# Altium schematic sheet BW1097_HDMI.SchDoc: =project_title
size Tabloid; CompanyName: Luxonis Holding; Organization: Luxonis Holding; Address1: 1925 Harmony Park Drive; Address2: Westminster, CO; Address3: 80234; Address4: United States; SheetNumber: 12; SheetTotal: 17
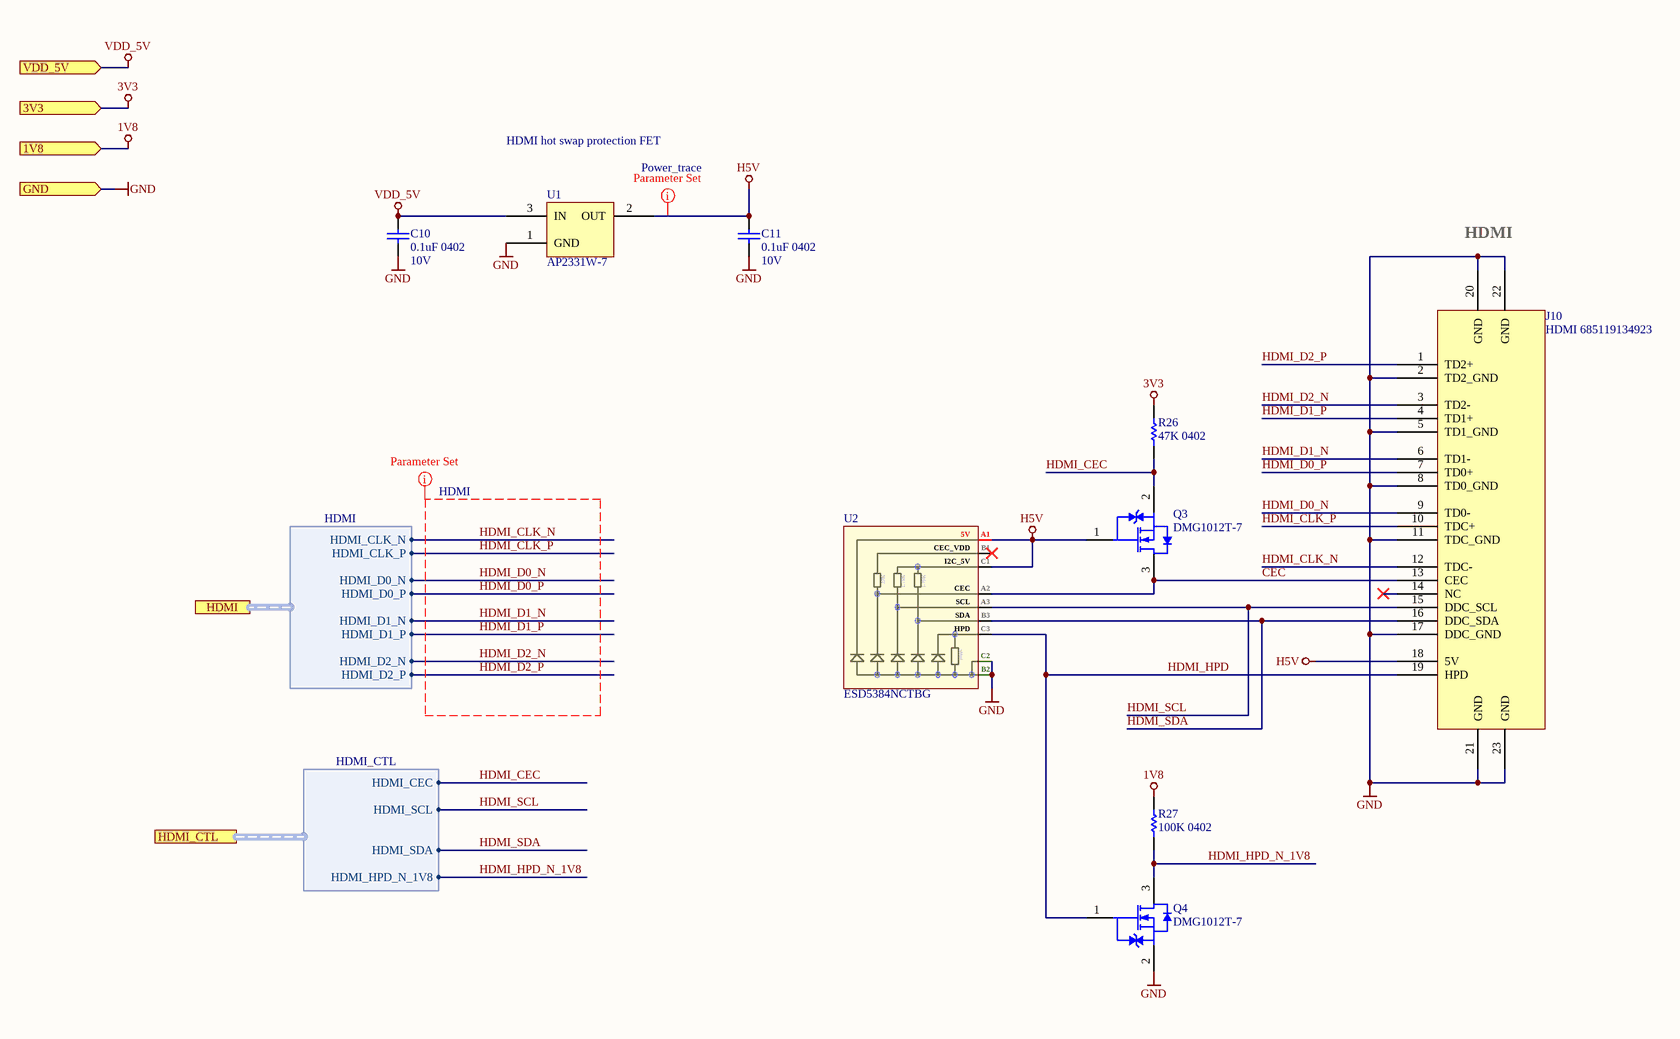
[diagram p0: BW1097_HDMI.SchDoc]

## Parts
C10  0.1uF 0402  Voltage Rating: 10V  [CAPC0402(1005)70_N]
C11  0.1uF 0402  Voltage Rating: 10V  [CAPC0402(1005)70_N]
J10  HDMI 685119134923  [685119134923]
Q3  DMG1012T-7  [DMG1012T-7]
Q4  DMG1012T-7  [DMG1012T-7]
R26  47K 0402  [RESC0402(1005)_N]
R27  100K 0402  [RESC0402(1005)_N]
U1  AP2331W-7  [AP2331W-7]
U2  ESD5384NCTBG  [ESD5384NCTBG]

## Ports
1V8 (in), 3V3 (in), GND (in), HDMI (harness HDMI), HDMI_CTL (harness HDMI_CTL), VDD_5V (in)

## Harnesses
HDMI_CTL: HDMI_CEC, HDMI_SCL, HDMI_SDA, HDMI_HPD_N_1V8
HDMI: HDMI_CLK_N, HDMI_CLK_P, HDMI_D0_N, HDMI_D0_P, HDMI_D1_N, HDMI_D1_P, HDMI_D2_N, HDMI_D2_P

## Nets
1V8: R27.2 ; port 1V8
3V3: R26.2 ; port 3V3
GND: C10.1 C11.1 J10.2(TD2_GND) J10.5(TD1_GND) J10.8(TD0_GND) J10.11(TDC_GND) J10.17(DDC_GND) J10.20(GND) J10.21(GND) J10.22(GND) J10.23(GND) Q4.2 U1.1(GND) U2.B2 U2.C2 ; port GND
H5V: C11.2 J10.18(5V) Q3.1 U1.2(OUT) U2.A1 U2.C1
VDD_5V: C10.2 U1.3(IN) ; port VDD_5V
CEC: J10.13(CEC) Q3.3 U2.A2
HDMI_CEC: Q3.2 R26.1 ; port HDMI_CTL.HDMI_CEC
HDMI_CLK_N: J10.12(TDC-) ; port HDMI.HDMI_CLK_N
HDMI_CLK_P: J10.10(TDC+) ; port HDMI.HDMI_CLK_P
HDMI_D0_N: J10.9(TD0-) ; port HDMI.HDMI_D0_N
HDMI_D0_P: J10.7(TD0+) ; port HDMI.HDMI_D0_P
HDMI_D1_N: J10.6(TD1-) ; port HDMI.HDMI_D1_N
HDMI_D1_P: J10.4(TD1+) ; port HDMI.HDMI_D1_P
HDMI_D2_N: J10.3(TD2-) ; port HDMI.HDMI_D2_N
HDMI_D2_P: J10.1(TD2+) ; port HDMI.HDMI_D2_P
HDMI_HPD: J10.19(HPD) Q4.1 U2.C3
HDMI_HPD_N_1V8: Q4.3 R27.1 ; port HDMI_CTL.HDMI_HPD_N_1V8
HDMI_SCL: J10.15(DDC_SCL) U2.A3 ; port HDMI_CTL.HDMI_SCL
HDMI_SDA: J10.16(DDC_SDA) U2.B3 ; port HDMI_CTL.HDMI_SDA

Not connected (* = marked no-connect by the designer): J10 14(NC)*; U2 B1*

## Layout directives
net class Power_trace: H5V
net class HDMI; rule Matched Net Lengths [Tolerance = 50mil]: HDMI_CLK_N, HDMI_CLK_P, HDMI_D0_N, HDMI_D0_P, HDMI_D1_N, HDMI_D1_P, HDMI_D2_N, HDMI_D2_P

## Notes on the sheet
- HDMI hot swap protection FET
- HDMI
- Title
- Size:
- Date:
- Tabloid
- Number:
- Time:
- Revision:
- Sheet
- of
- Drawn by:
- (in symbol ESD5384NCTBG) 5V; CEC_VDD; I2C_5V; 27K; 1.75K; CEC; SCL; SDA; HPD; 100K

## Library data of the parts
C10 C11 = GRM155R71A104JA01D: CAP CER 0.1UF 10V X7R 0402 5%; Manufacturer 1: Murata; Capacitance: 100nF; Manufacturer Part Number 1: GRM155R71A104JA01D; Supplier 1: Digi-Key; Stock 1: 1346709; Pricing 1: 1=0.10000, 10=0.02500, 100=0.01130, 500=0.00806, 1000=0.00633, 2500=0.00575, 5000=0.00529 (USD); RoHS: Yes; Mount: Surface Mount; Case/Package: 0402; Case Code (Imperial): 0402; Case Code (Metric): 1005; Min Operating Temperature: -55°C; Max Operating Temperature: 125°C; Tolerance: 5%; Packaging: Tape and Reel; Voltage Rating (DC): 10V; Dielectric: X7R; Package Quantity: 10000; Termination: SMD/SMT; Length: 1mm; Height: 0.5mm; Width: 0.02inch; Thickness: 0.022inch; Depth: 0.5mm; Radiation Hardening: No; Lead Free: Lead Free; ComponentLink1URL: https://datasheet.ciiva.com/5411/product-5411135.pdf?src-supplier=Mouser; ComponentLink1Description: https://datasheet.ciiva.com/5411/product-5411135.pdf?src-supplier=Mouser; ComponentLink2URL: https://datasheet.ciiva.com/11618/c02e-11618821.pdf?src-supplier=Avnet; ComponentLink2Description: https://datasheet.ciiva.com/11618/c02e-11618821.pdf?src-supplier=Avnet; Supplier Part Number 1: 490-10777-1-ND
J10 = 685119134923: CONN RCPT HDMI 19POS SMD R/A; Manufacturer 1: Wurth Electronics; Body Material: Plastic; Gender: Receptacle; Connector Type: HDMI,Socket; Number of Contacts: 19; Manufacturer Part Number 1: 685119134923; Supplier 1: Digi-Key; Stock 1: 3955; Pricing 1: 1=2.36000, 10=2.33000, 50=2.11100, 100=1.89300 (USD); RoHS: Yes; Mount: Surface Mount,Horizontal; Contact Material: Bronze; Color: Black; Package Quantity: 250; Packaging: Tape and Reel; Number of Positions: 19; Termination: SMD/SMT; Orientation: Right Angle; Features: Shielded; Length: 12.15mm; Height: 5.55mm; Width: 15mm; REACH SVHC: Unknown; ComponentLink1URL: https://datasheet.ciiva.com/851/685119134923-851552.pdf?src-supplier=Digi-Key; ComponentLink1Description: https://datasheet.ciiva.com/851/685119134923-851552.pdf?src-supplier=Digi-Key; ComponentLink2URL: https://datasheet.ciiva.com/5053/685119134923-63804-5053219.pdf?src-supplier=Mouser; ComponentLink2Description: https://datasheet.ciiva.com/5053/685119134923-63804-5053219.pdf?src-supplier=Mouser; ComponentLink3URL: https://datasheet.ciiva.com/1095/638362-1095543.pdf?src-supplier=Newark; ComponentLink3Description: https://datasheet.ciiva.com/1095/638362-1095543.pdf?src-supplier=Newark; ComponentLink4URL: https://datasheet.ciiva.com/851/685119134923-851553.pdf?src-supplier=Digi-Key; ComponentLink4Description: https://datasheet.ciiva.com/851/685119134923-851553.pdf?src-supplier=Digi-Key; ComponentLink5URL: https://datasheet.ciiva.com/1094/638362-1094939.pdf?src-supplier=Element14; ComponentLink5Description: https://datasheet.ciiva.com/1094/638362-1094939.pdf?src-supplier=Element14; ComponentLink6URL: https://datasheet.ciiva.com/14118/4257090-eng-datasheet-14118205.pdf?src-supplier=Distrelec; ComponentLink6Description: https://datasheet.ciiva.com/14118/4257090-eng-datasheet-14118205.pdf?src-supplier=Distrelec; Supplier Part Number 1: 732-2737-1-ND; Supplier 2: Newark; Supplier 3: Mouser; Supplier Part Number 2: 13T9717; Supplier Part Number 3: 710-685119134923
Q3 Q4 = DMG1012T-7: MOSFET N-CH 20V 630MA SOT-523; Manufacturer 1: Diodes; Rds On Max: 400mR; Input Capacitance: 60.67pF; Max Power Dissipation: 280mW; Rise Time: 7.4ns; Fall Time: 12.3ns; Turn-On Delay Time: 5.1ns; Turn-Off Delay Time: 26.7ns; Gate to Source Voltage (Vgs): 6V; Number of Elements: 1; Drain to Source Resistance: 300mR; Element Configuration: Single; Threshold Voltage: 1V; FET Type: 1 N-Channel; Manufacturer Part Number 1: DMG1012T-7; Supplier 1: Digi-Key; Stock 1: 1268946; Pricing 1: 1=0.30000, 10=0.24600, 100=0.10070, 500=0.08396, 1000=0.05834 (USD); RoHS: Yes; Mount: Surface Mount; Case/Package: SOT-523; Number of Pins: 3; Weight: 7.1E-05oz; Contact Plating: Tin,Matte; Min Operating Temperature: -55°C; Max Operating Temperature: 150°C; Continuous Drain Current (ID): 630mA; Packaging: Tape and Reel; Drain to Source Voltage (Vdss): 20V; Package Quantity: 3000; Drain to Source Breakdown Voltage: 20V; Power Dissipation: 280mW; Number of Channels: 1; On-State Resistance: 400MR; Length: 1.7mm; Height: 0.8mm; Width: 0.85mm; Radiation Hardening: No; REACH SVHC: No SVHC; Lead Free: Lead Free; ComponentLink1URL: https://datasheet.ciiva.com/934/ds31783-934512.pdf?src-supplier=Digi-Key; ComponentLink1Description: https://datasheet.ciiva.com/934/ds31783-934512.pdf?src-supplier=Digi-Key; ComponentLink2URL: https://datasheet.ciiva.com/4442/ds31783-44973-4442944.pdf?src-supplier=Mouser; ComponentLink2Description: https://datasheet.ciiva.com/4442/ds31783-44973-4442944.pdf?src-supplier=Mouser; ComponentLink3URL: https://datasheet.ciiva.com/11174/ds31783-11174965.pdf?src-supplier=Avnet; ComponentLink3Description: https://datasheet.ciiva.com/11174/ds31783-11174965.pdf?src-supplier=Avnet; ComponentLink4URL: https://datasheet.ciiva.com/17324/ds31783-17324010.pdf?src-supplier=Avnet+Europe; ComponentLink4Description: https://datasheet.ciiva.com/17324/ds31783-17324010.pdf?src-supplier=Avnet+Europe; ComponentLink5URL: https://datasheet.ciiva.com/6383/ds31783-6383803.pdf?src-supplier=Digi-Key; ComponentLink5Description: https://datasheet.ciiva.com/6383/ds31783-6383803.pdf?src-supplier=Digi-Key; ComponentLink6URL: https://datasheet.ciiva.com/934/ds31783-934511.pdf?src-supplier=Digi-Key; ComponentLink6Description: https://datasheet.ciiva.com/934/ds31783-934511.pdf?src-supplier=Digi-Key; Supplier Part Number 1: DMG1012T-7DICT-ND; Supplier 2: Mouser; Supplier Part Number 2: 621-DMG1012T-7
R26 = RC0402FR-0747KL: RES SMD 47K OHM 1% 1/16W 0402; Manufacturer 1: Yageo; Resistance: 47kR; Power Rating: 62.5mW; Temperature Coefficient: 100ppm/°C; Voltage Rating: 50V; Max Power Dissipation: 63mW; Manufacturer Part Number 1: RC0402FR-0747KL; Supplier 1: Digi-Key; Stock 1: 8672261; Pricing 1: 1=0.10000, 10=0.01600, 100=0.00640, 1000=0.00289, 2500=0.00251, 5000=0.00207 (USD); RoHS: Yes; Case/Package: 0402; Case Code (Imperial): 0402; Case Code (Metric): 1005; Min Operating Temperature: -55°C; Max Operating Temperature: 155°C; Tolerance: 1%; Packaging: Tape and Reel; Composition: Thick Film; Termination: SMD/SMT; Package Quantity: 1; Number of Terminations: 2; Military Standard: Not; Features: Moisture Resistant; Length: 1mm; Height: 0.016inch; Width: 0.5mm; Depth: 0.5mm; Lead Free: Lead Free; REACH SVHC: Unknown; ComponentLink1URL: https://datasheet.ciiva.com/16793/pyu-rc0402-51-rohs-l-6-r-16793430.pdf?src-supplier=Future+Electronics; ComponentLink1Description: https://datasheet.ciiva.com/16793/pyu-rc0402-51-rohs-l-6-r-16793430.pdf?src-supplier=Future+Electronics; ComponentLink2URL: https://datasheet.ciiva.com/46412/1018594-46412839.pdf?src-supplier=Element14; ComponentLink2Description: https://datasheet.ciiva.com/46412/1018594-46412839.pdf?src-supplier=Element14; ComponentLink3URL: https://datasheet.ciiva.com/15189/getdatasheetpartid-323748-15189466.pdf?src-supplier=Verical; ComponentLink3Description: https://datasheet.ciiva.com/15189/getdatasheetpartid-323748-15189466.pdf?src-supplier=Verical; ComponentLink4URL: https://datasheet.ciiva.com/2453/pyu-r-int-thick-7-2453388.pdf?src-supplier=Digi-Key; ComponentLink4Description: https://datasheet.ciiva.com/2453/pyu-r-int-thick-7-2453388.pdf?src-supplier=Digi-Key; ComponentLink5URL: https://datasheet.ciiva.com/2453/pyu-r-int-thick-7-2453389.pdf?src-supplier=Digi-Key; ComponentLink5Description: https://datasheet.ciiva.com/2453/pyu-r-int-thick-7-2453389.pdf?src-supplier=Digi-Key; ComponentLink6URL: https://datasheet.ciiva.com/2453/pyu-r-int-thick-7-2453390.pdf?src-supplier=Digi-Key; ComponentLink6Description: https://datasheet.ciiva.com/2453/pyu-r-int-thick-7-2453390.pdf?src-supplier=Digi-Key; Supplier 2: Newark; Supplier Part Number 1: 311-47.0KLRCT-ND; Supplier Part Number 2: 26M6788
R27 = RC0402FR-07100KL: RES SMD 100K OHM 1% 1/16W 0402; Manufacturer 1: Yageo; Power Rating: 63mW; Resistance: 100kR; Temperature Coefficient: 100ppm/°C; Voltage Rating: 50V; Manufacturer Part Number 1: RC0402FR-07100KL; Supplier 1: Digi-Key; Stock 1: 50867324; Pricing 1: 1=0.10000, 10=0.01500, 100=0.00600, 1000=0.00270, 2500=0.00235, 5000=0.00194 (USD); RoHS: Yes; Case/Package: 0402; Case Code (Metric): 1005; Case Code (Imperial): 0402; Min Operating Temperature: -55°C; Max Operating Temperature: 155°C; Tolerance: 1%; Packaging: Tape and Reel; Composition: Thick Film; Termination: SMD/SMT; Military Standard: Not; Package Quantity: 1; Number of Terminations: 2; Max Power Dissipation: 63mW; Features: Moisture Resistant; Working Voltage: 50V; Length: 0.039inch; Height: 0.016inch; Width: 0.02inch; Depth: 0.5mm; Lead Free: Lead Free; REACH SVHC: No SVHC; ComponentLink1URL: https://datasheet.ciiva.com/11819/0900766b80c66297-11819452.pdf?src-supplier=RSComponents; ComponentLink1Description: https://datasheet.ciiva.com/11819/0900766b80c66297-11819452.pdf?src-supplier=RSComponents; ComponentLink2URL: https://datasheet.ciiva.com/2453/pyu-r-int-thick-7-2453361.pdf?src-supplier=Digi-Key; ComponentLink2Description: https://datasheet.ciiva.com/2453/pyu-r-int-thick-7-2453361.pdf?src-supplier=Digi-Key; ComponentLink3URL: https://datasheet.ciiva.com/2453/pyu-r-int-thick-7-2453362.pdf?src-supplier=Digi-Key; ComponentLink3Description: https://datasheet.ciiva.com/2453/pyu-r-int-thick-7-2453362.pdf?src-supplier=Digi-Key; ComponentLink4URL: https://datasheet.ciiva.com/2453/pyu-r-int-thick-7-2453363.pdf?src-supplier=Digi-Key; ComponentLink4Description: https://datasheet.ciiva.com/2453/pyu-r-int-thick-7-2453363.pdf?src-supplier=Digi-Key; ComponentLink5URL: https://datasheet.ciiva.com/22747/1018594-22747509.pdf?src-supplier=Element14; ComponentLink5Description: https://datasheet.ciiva.com/22747/1018594-22747509.pdf?src-supplier=Element14; ComponentLink6URL: https://datasheet.ciiva.com/15189/getdatasheetpartid-323696-15189334.pdf?src-supplier=Verical; ComponentLink6Description: https://datasheet.ciiva.com/15189/getdatasheetpartid-323696-15189334.pdf?src-supplier=Verical; ComponentLink7URL: https://datasheet.ciiva.com/12667/pyu-rc0402-51-rohs-l-6-r-12667930.pdf?src-supplier=Mouser; ComponentLink7Description: https://datasheet.ciiva.com/12667/pyu-rc0402-51-rohs-l-6-r-12667930.pdf?src-supplier=Mouser; Supplier 2: Newark; Supplier 3: Mouser; Supplier Part Number 1: 311-100KLRCT-ND; Supplier Part Number 2: 67R9887; Supplier Part Number 3: 603-RC0402FR-07100KL
U1 = AP2331W-7: LOAD SWITCH SC59; Manufacturer 1: Diodes; Number of Outputs: 1; Output Current: 200mA; Max Supply Voltage: 5.2V; Min Supply Voltage: 2.7V; Interface: On/Off; On-State Resistance: 350mR; Turn-On Delay Time: 700us; Fault Protection: Over Temperature,Reverse Current; Output Configuration: High Side; Manufacturer Part Number 1: AP2331W-7; Supplier 1: Digi-Key; Stock 1: 5467; Pricing 1: 1=0.40000, 10=0.34100, 100=0.23660, 500=0.19110, 1000=0.14105 (USD); RoHS: Yes; Mount: Surface Mount; Case/Package: TO-236-3; Number of Pins: 59; Min Operating Temperature: -40°C; Max Operating Temperature: 85°C; Package Quantity: 3000; Packaging: Tape and Reel; Max Output Current: 200mA; Voltage: 5.2V; Current: 200mA; Length: 3.1mm; Height: 1.3mm; Width: 1.7mm; Radiation Hardening: No; REACH SVHC: No SVHC; ComponentLink1URL: https://datasheet.ciiva.com/18567/ap2331-18567929.pdf?src-supplier=Digi-Key; ComponentLink1Description: https://datasheet.ciiva.com/18567/ap2331-18567929.pdf?src-supplier=Digi-Key; ComponentLink2URL: https://datasheet.ciiva.com/18567/ap2331-18567928.pdf?src-supplier=Digi-Key; ComponentLink2Description: https://datasheet.ciiva.com/18567/ap2331-18567928.pdf?src-supplier=Digi-Key; ComponentLink3URL: https://datasheet.ciiva.com/18567/ap2331-18567930.pdf?src-supplier=Digi-Key; ComponentLink3Description: https://datasheet.ciiva.com/18567/ap2331-18567930.pdf?src-supplier=Digi-Key; Supplier 2: Mouser; Supplier 3: Arrow; Supplier Part Number 2: 621-AP2331W-7; Supplier Part Number 1: AP2331W-7DICT-ND; Supplier Part Number 3: AP2331W-7
U2 = ESD5384NCTBG: TVS DIODE 3V 9WLCSP; Manufacturer 1: ON Semiconductor; Direction: Unidirectional; Min Breakdown Voltage: 6V; ESD Protection: Yes; Max Reverse Leakage Current: 200nA; Number of Lines: 5; Capacitance: 29pF; Power Line Protection: No; Manufacturer Part Number 1: ESD5384NCTBG; Supplier 1: Digi-Key; Stock 1: 729; Pricing 1: 1=0.45000, 10=0.38600, 100=0.26780, 500=0.20910, 1000=0.16995 (USD); RoHS: Yes; Number of Pins: 9; Min Operating Temperature: -30°C; Max Operating Temperature: 85°C; Package Quantity: 5000; Packaging: Tape and Reel; Reverse Standoff Voltage: 3V; Number of Unidirectional Channels: 5; Composition: Zener; Length: 1.14mm; Height: 0.63mm; Width: 1.14mm; Depth: 1.14mm; Radiation Hardening: No; Lead Free: Lead Free; Halogen Free: Halogen Free; ComponentLink1URL: https://datasheet.ciiva.com/11195/esd5384-d-11195286.pdf?src-supplier=Avnet; ComponentLink1Description: https://datasheet.ciiva.com/11195/esd5384-d-11195286.pdf?src-supplier=Avnet; ComponentLink2URL: https://datasheet.ciiva.com/12545/esd5384-d-119513-12545067.pdf?src-supplier=Mouser; ComponentLink2Description: https://datasheet.ciiva.com/12545/esd5384-d-119513-12545067.pdf?src-supplier=Mouser; ComponentLink3URL: https://datasheet.ciiva.com/354/esd5384-d-354168.pdf?src-supplier=Digi-Key; ComponentLink3Description: https://datasheet.ciiva.com/354/esd5384-d-354168.pdf?src-supplier=Digi-Key; Supplier 2: RSComponents; Supplier Part Number 1: ESD5384NCTBGOSCT-ND; Supplier Part Number 2: 8010213